# Altium schematic sheet TamagotchiMainBoard.SchDoc
size A
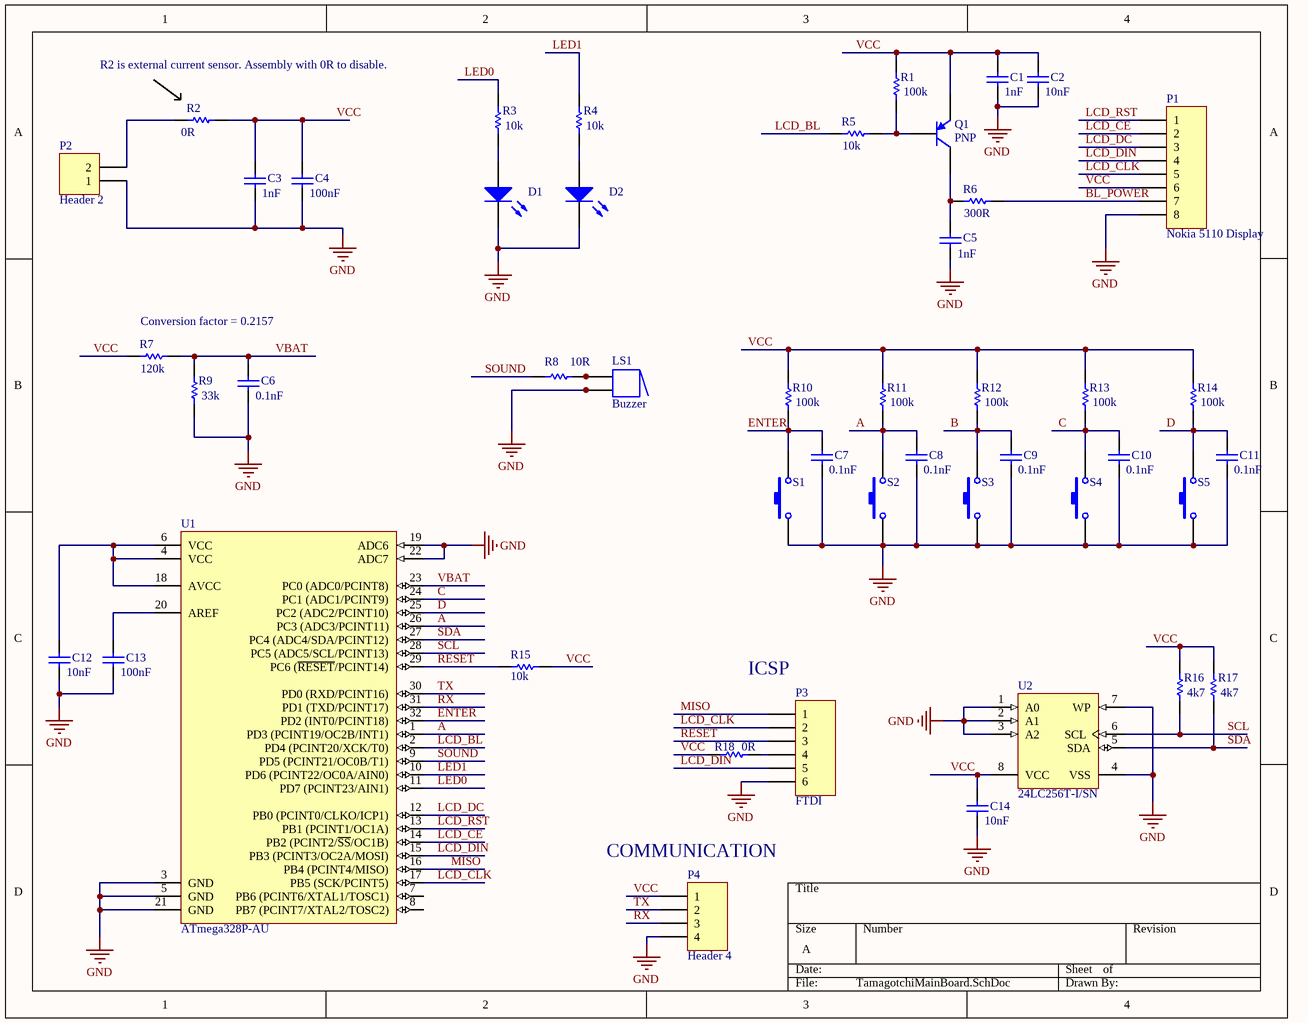
[diagram p0: TamagotchiMainBoard.SchDoc]

## Parts
C1  value 1nF  [C0805]  (hidden comment: Cap)
C2  value 10nF  [C0805]  (hidden comment: Cap)
C3  value 1nF  [C0805]  (hidden comment: Cap)
C4  value 100nF  [C0805]  (hidden comment: Cap)
C5  value 1nF  [C0805]  (hidden comment: Cap)
C6  value 0.1nF  [C0805]  (hidden comment: Cap)
C7  value 0.1nF  [C0805]  (hidden comment: Cap)
C8  value 0.1nF  [C0805]  (hidden comment: Cap)
C9  value 0.1nF  [C0805]  (hidden comment: Cap)
C10  value 0.1nF  [C0805]  (hidden comment: Cap)
C11  value 0.1nF  [C0805]  (hidden comment: Cap)
C12  value 10nF  [C0805]  (hidden comment: Cap)
C13  value 100nF  [C0805]  (hidden comment: Cap)
C14  value 10nF  [C0805]  (hidden comment: Cap)
D1  LED0  [6-0805_M]  (value not drawn)
D2  LED0  [6-0805_M]  (value not drawn)
LS1  Buzzer  [ABSM-1574]
P1  Nokia 5110 Display  [HDR1X8]
P2  Header 2  [HDR1X2]
P3  FTDI  [HDR1X6]
P4  Header 4  [HDR1X4]
Q1  PNP  [SOT-23B_N]
R1  value 100k  [6-0805_M]  (hidden comment: Res1)
R2  value 0R  [6-0805_M]  (hidden comment: Res1)
R3  value 10k  [6-0805_M]  (hidden comment: Res1)
R4  value 10k  [6-0805_M]  (hidden comment: Res1)
R5  value 10k  [6-0805_M]  (hidden comment: Res1)
R6  value 300R  [6-0805_M]  (hidden comment: Res1)
R7  value 120k  [6-0805_M]  (hidden comment: Res1)
R8  value 10R  [6-0805_M]  (hidden comment: Res1)
R9  value 33k  [6-0805_M]  (hidden comment: Res1)
R10  value 100k  [6-0805_M]  (hidden comment: Res1)
R11  value 100k  [6-0805_M]  (hidden comment: Res1)
R12  value 100k  [6-0805_M]  (hidden comment: Res1)
R13  value 100k  [6-0805_M]  (hidden comment: Res1)
R14  value 100k  [6-0805_M]  (hidden comment: Res1)
R15  value 10k  [6-0805_M]  (hidden comment: Res1)
R16  value 4k7  [6-0805_M]  (hidden comment: Res1)
R17  value 4k7  [6-0805_M]  (hidden comment: Res1)
R18  value 0R  [6-0805_M]  (hidden comment: Res1)
S1  SW-PB  [SPST-2]  (value not drawn)
S2  SW-PB  [SPST-2]  (value not drawn)
S3  SW-PB  [SPST-2]  (value not drawn)
S4  SW-PB  [SPST-2]  (value not drawn)
S5  SW-PB  [SPST-2]  (value not drawn)
U1  ATmega328P-AU  [32A_N]
U2  24LC256T-I/SN  [SOIC-SN8_N]

## Nets
GND: C1.1 C2.1 C3.1 C4.1 C5.1 C6.2 C7.2 C8.2 C9.2 C10.2 C11.2 C12.1 C13.1 C14.1 D1.2(K) D2.2(K) LS1.2 LS1.2A P1.8 P2.1 P3.6 P4.4 R9.2 S1.1 S2.1 S3.1 S4.1 S5.1 U1.3(GND) U1.5(GND) U1.19(ADC6) U1.21(GND) U1.22(ADC7) U2.1(A0) U2.2(A1) U2.3(A2) U2.4(VSS) U2.7(WP)
A: C8.1 R11.2 S2.2 U1.1(PD3_(PCINT19/OC2B/INT1)) U1.26(PC3_(ADC3/PCINT11))
B: C9.1 R12.2 S3.2
BL_POWER: P1.7 R6.1
C: C10.1 R13.2 S4.2 U1.24(PC1_(ADC1/PCINT9))
D: C11.1 R14.2 S5.2 U1.25(PC2_(ADC2/PCINT10))
ENTER: C7.1 R10.2 S1.2 U1.32(PD2_(INT0/PCINT18))
LCD_BL: R5.2 U1.2(PD4_(PCINT20/XCK/T0))
LCD_CE: P1.2 U1.14(PB2_(PCINT2/~{SS}/OC1B))
LCD_CLK: P1.5 P3.2 U1.17(PB5_(SCK/PCINT5))
LCD_DC: P1.3 U1.12(PB0_(PCINT0/CLKO/ICP1))
LCD_DIN: P1.4 P3.5 U1.15(PB3_(PCINT3/OC2A/MOSI))
LCD_RST: P1.1 U1.13(PB1_(PCINT1/OC1A))
LED0: R3.1 U1.11(PD7_(PCINT23/AIN1))
LED1: R4.1 U1.10(PD6_(PCINT22/OC0A/AIN0))
MISO: P3.1 U1.16(PB4_(PCINT4/MISO))
RESET: P3.3 R15.1 U1.29(PC6_(~{RESET}/PCINT14))
RX: P4.3 U1.31(PD1_(TXD/PCINT17))
SCL: R16.2 U1.28(PC5_(ADC5/SCL/PCINT13)) U2.6(SCL)
SDA: R17.2 U1.27(PC4_(ADC4/SDA/PCINT12)) U2.5(SDA)
SOUND: R8.1 U1.9(PD5_(PCINT21/OC0B/T1))
TX: P4.2 U1.30(PD0_(RXD/PCINT16))
VBAT: C6.1 R7.1 R9.1 U1.23(PC0_(ADC0/PCINT8))
VCC: C1.2 C2.2 C3.2 C4.2 C14.2 P1.6 P4.1 Q1.3(E) R1.1 R2.1 R7.2 R10.1 R11.1 R12.1 R13.1 R14.1 R15.2 R16.1 R17.1 R18.1 U2.8(VCC)
NetC5_2: C5.2 Q1.1(C) R6.2
NetC12_2: C12.2 U1.4(VCC) U1.6(VCC) U1.18(AVCC)
NetC13_2: C13.2 U1.20(AREF)
NetD1_1: D1.1(A) R3.2
NetD2_1: D2.1(A) R4.2
NetLS1_1: LS1.1 LS1.1A R8.2
NetP2_2: P2.2 R2.2
NetP3_4: P3.4 R18.2
NetQ1_2: Q1.2(B) R1.2 R5.1

Not connected (* = marked no-connect by the designer): U1 7(PB6_(PCINT6/XTAL1/TOSC1)) 8(PB7_(PCINT7/XTAL2/TOSC2))

## Notes on the sheet
- R2 is external current sensor. Assembly with 0R to disable.
- (near R7) Conversion factor = 0.2157
- (near P3) ICSP
- (near P4) COMMUNICATION

## Library data of the parts
C1-C14 = Cap: Capacitor; Published: 8-Jun-2000; LatestRevisionDate: 17-Jul-2002; LatestRevisionNote: Re-released for DXP Platform.; PackageReference: RAD-0.3; Publisher: Altium Limited; PackageDescription: Radial Cap, Thru-Hole; 2 Leads; 0.3 in Pin Spacing
D1 D2 = LED0: Typical INFRARED GaAs LED; Published: 8-Jun-2000; LatestRevisionDate: 08-Jul-2005; LatestRevisionNote: Mech Layer 1 removed.; PackageReference: LED-0; Publisher: Altium Limited; PackageDescription: LED; 2 Leads
LS1 = Buzzer: Magnetic Transducer Buzzer; Published: 24-Mar-1999; LatestRevisionDate: 17-Dec-2003; LatestRevisionNote: Schematic revised, PCB Footprint replaced.; DatasheetVersion: 17-Dec-2003; PackageReference: ABSM-1574; Publisher: Altium Limited; PackageDescription: Magnetic Transducer Buzzer; ComponentLink1Description: Manufacturer Link; ComponentLink1URL: http://www.megastar.com/linecard/buzzmode/index.php
P1 = Header 8: Header, 8-Pin; LatestRevisionDate: 17-Jul-2002; LatestRevisionNote: Re-released for DXP Platform.; Publisher: Altium Limited
P2 = Header 2: Header, 2-Pin; LatestRevisionDate: 17-Jul-2002; LatestRevisionNote: Re-released for DXP Platform.; Publisher: Altium Limited
P3 = Header 6: Header, 6-Pin; LatestRevisionDate: 17-Jul-2002; LatestRevisionNote: Re-released for DXP Platform.; Publisher: Altium Limited
P4 = Header 4: Header, 4-Pin; LatestRevisionDate: 17-Jul-2002; LatestRevisionNote: Re-released for DXP Platform.; Publisher: Altium Limited
Q1 = PNP: PNP Bipolar Transistor; Published: 8-Jun-2000; LatestRevisionDate: 29-May-2009; LatestRevisionNote: IPC-7351 Footprint Added.; PackageVersion: Aug-1999; PackageReference: SOT-23B; Publisher: Altium Limited; PackageDescription: 3-Pin SOT-23 Package 0.95 mm Pitch, 2.4 mm Lead Span
R1-R18 = Res1: Resistor; Published: 8-Jun-2000; LatestRevisionDate: 17-Jul-2002; LatestRevisionNote: Re-released for DXP Platform.; PackageReference: AXIAL-0.3; Publisher: Altium Limited; PackageDescription: Axial Device, Thru-Hole; 2 Leads; 0.3 in Pin Spacing
S1-S5 = SW-PB: Switch; Published: 24-Mar-1999; LatestRevisionDate: 17-Jul-2002; LatestRevisionNote: Re-released for DXP Platform.; PackageReference: SPST-2; Publisher: Altium Limited; PackageDescription: Switch; 2 Leads
U1 = ATmega328P-AU: 8-bit AVR Microcontroller, 32KB Flash, 1KB EEPROM, 2KB SRAM, 32-pin TQFP, Industrial Grade (-40°C to 85°C); Published: 1-Apr-2010; DatasheetVersion: revA, Jan-2010; PackageVersion: revB, Oct-2001; PackageReference: 32A; Publisher: Altium Limited; PackageDescription: 32-Lead, 7x7x1.0 mm Body, 0.8mm Lead Pitch, Thin Profile Plastic Quad Flat Package (TQFP); Supplier 1: Digi-Key; Supplier Part Number 1: ATMEGA328P-AU-ND; Supplier 2: Farnell; Supplier Part Number 2: 1715486; Supplier 3: Mouser; Supplier Part Number 3: 556-ATMEGA328P-AU; Code_JEDEC: MS-026-ABA; ComponentLink1Description: Manufacturer Link; ComponentLink1URL: http://www.atmel.com/products/avr/default.asp?; ComponentLink2Description: ATmega48A/48PA/88A/88PA/168A/168PA/328/328P Datasheet; ComponentLink2URL: http://www.atmel.com/dyn/resources/prod_documents/8271.pdf; ComponentLink3Description: ATmega48A/48PA/88A/88PA/168A/168PA/328/328P Summary; ComponentLink3URL: http://www.atmel.com/dyn/resources/prod_documents/8271S.pdf; ComponentLink4Description: Atmel.com Home; ComponentLink4URL: http://www.atmel.com
U2 = 24LC256T-I/SN: 256Kbit, 400kHz, 2.5V, I2C Serial EEPROM, 8-Pin SOIC 150mil, Industrial Temperature, Tape and Reel; Published: 29-Jan-2009; DatasheetVersion: revP, Oct-2007; PackageVersion: revBB, Aug-2009; PackageReference: SOIC-SN8; Publisher: Altium Limited; PackageDescription: 8-Lead Plastic Small Outline (SN) - Narrow, 3.90mm Body [SOIC]; Supplier 1: Digi-Key; Supplier Part Number 1: 24LC256T-I/SNTR-ND; Supplier 2: Digi-Key; Supplier Part Number 2: 24LC256T-I/SNCT-ND; Supplier 3: Digi-Key; Supplier Part Number 3: 24LC256T-I/SNDKR-ND; Supplier 4: Farnell; Supplier Part Number 4: 1296581; Code_JEDEC: MS-012; Code_IPC: SOIC127P600-8; ComponentLink1Description: Datasheet; ComponentLink1URL: http://ww1.microchip.com/downloads/en/DeviceDoc/21203P.pdf; ComponentLink2Description: Packaging Specification; ComponentLink2URL: http://www.microchip.com/stellent/groups/techpub_sg/documents/packagingspec/en012702.pdf; ComponentLink3Description: Microchip.com Home; ComponentLink3URL: http://www.microchip.com/